# Altium schematic sheet switch.SchDoc: RF Switch
size Letter; CheckedBy: J. Brinton; CompanyName: Signal Laboratories, Inc.; DrawnBy: J. Brinton; Engineer: J. Brinton; Address1: 3479 Edison Way; Address2: Menlo Park CA 94025; Address3: +1 (877) 778-8435; Address4: siglabs.com; Revision: 3; SheetNumber: 16; SheetTotal: 49
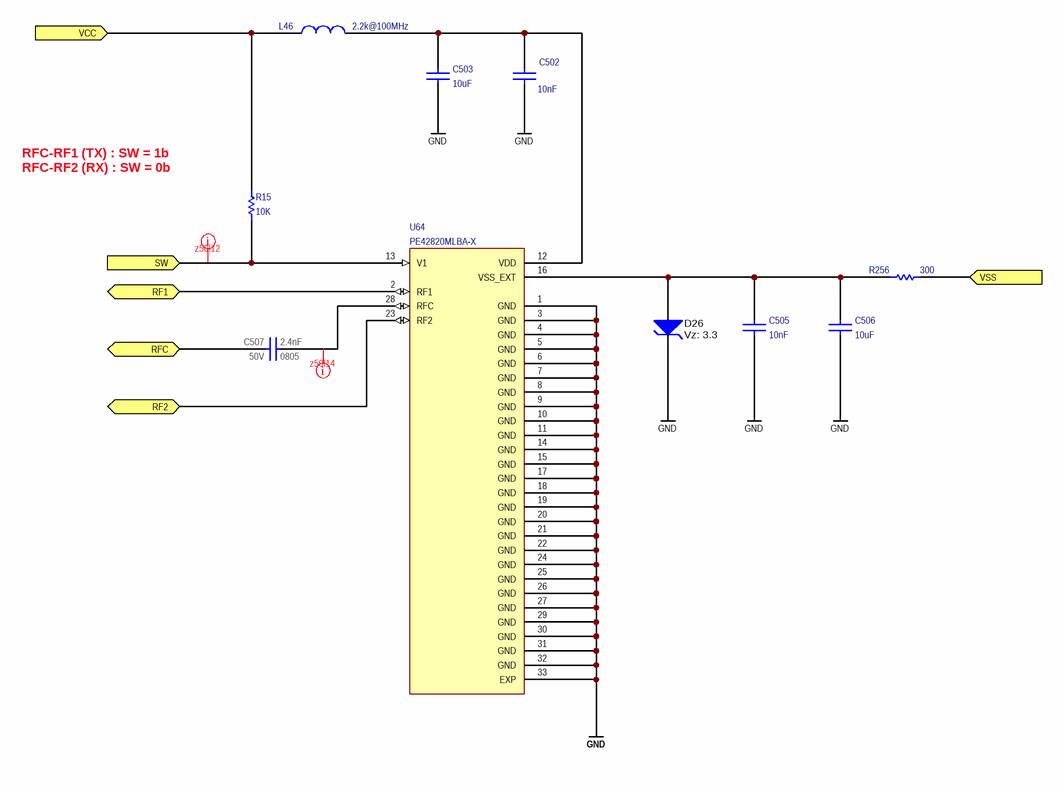
[diagram p0: switch.SchDoc]

## Parts
C502  value 10nF  [CAPC100X50X55L25N]  (hidden comment: GRM155R71H103KA88)
C503  value 10uF  [CAPC160X80X90L20N]  (hidden comment: ZRB18AR61E106ME01L)
C505  value 10nF  [CAPC100X50X55L25N]  (hidden comment: GRM155R71H103KA88)
C506  value 10uF  [CAPC160X80X90L20N]  (hidden comment: ZRB18AR61E106ME01L)
C507  value 2.4nF  Voltage: 50V  Package: 0805  [CAPC2012X145N]  (hidden comment: C08BL242X-5UN-X0T)
D26  Vz: 3.3  [SOD523]  (hidden comment: BZT585B3V3T-7)
L46  value 2.2k@100MHz  [INDC1005X55N]  (hidden comment: MMZ1005A222ET000)
R15  value 10K  [RESC1005X40N]  (hidden comment: ERJ-2RKF1002X)
R256  value 300  [RESC2012X70N]  (hidden comment: RG2012P-301-B-T5)
U64  PE42820MLBA-X  [QFN50P500X500X90-32N]

## Ports
RF1 (bidir), RF2 (bidir), RFC (bidir), SW (in), VCC (in), VSS (in)

## Nets
GND: C502.1 C503.1 C505.1 C506.1 D26.1(K) U64.1(GND) U64.3(GND) U64.4(GND) U64.5(GND) U64.6(GND) U64.7(GND) U64.8(GND) U64.9(GND) U64.10(GND) U64.11(GND) U64.14(GND) U64.15(GND) U64.17(GND) U64.18(GND) U64.19(GND) U64.20(GND) U64.21(GND) U64.22(GND) U64.24(GND) U64.25(GND) U64.26(GND) U64.27(GND) U64.29(GND) U64.30(GND) U64.31(GND) U64.32(GND) U64.33(EXP)
RF1: U64.2(RF1) ; port RF1
RF2: U64.23(RF2) ; port RF2
RFC: C507.2 ; port RFC
SW: R15.1 U64.13(V1) ; port SW
VCC: L46.1 R15.2 ; port VCC
VSS: R256.2 ; port VSS
NetC502_2: C502.2 C503.2 L46.2 U64.12(VDD)
NetC505_2: C505.2 C506.2 D26.2(A) R256.1 U64.16(VSS_EXT)
NetC507_1: C507.1 U64.28(RFC)

## Layout directives
net class z50l14: NetC507_1
net class z50l12: SW

## Notes on the sheet
- RFC-RF1 (TX) : SW = 1b
- RFC-RF2 (RX) : SW = 0b
- Title
- Engineer
- Revision
- Drawn By
- Checked By
- Date
- Sheet
- of

## Library data of the parts
C502 C505 = CAP 0402: Ceramic Capacitor 10nF ±10% 50V X7R 0402; Manufacturer: Murata; Tr: -55:125; Voltage: 50V; Manufacturer P/N: GRM155R71H103KA88; Package: 0402; Tolerance: ±10%
C503 C506 = CAP 0603: Ceramic Capacitor 10uF ±20% 25V X5R 0603; Manufacturer: Murata; Tr: -55:85; Manufacturer P/N: ZRB18AR61E106ME01L; Voltage: 25V; Package: 0603; Tolerance: ±20%
C507 = CAP: Ceramic Capacitor 2.4nF 50V 0805; Manufacturer: Dielectric Laboratories; Tr: -55:105; Manufacturer P/N: C08BL242X-5UN-X0T
D26 = ZENER: 3.3V Zener Diode SOD-523; Manufacturer: Diodes Inc; Manufacturer P/N: BZT585B3V3T-7
L46 = INDUCTANCE1: Ferrite Bead 2.2k@100MHz 150mA 0402; Manufacturer: TDK; Tr: -55:125; Manufacturer P/N: MMZ1005A222ET000; Package: 0402
R15 = RES 0402: Thick Film Resistor 10k ±1% 0.1W 50V 0402; Manufacturer: Panasonic; Tr: -55:155; Package: 0402; Manufacturer P/N: ERJ-2RKF1002X; Tolerance: ±1%
R256 = RES: Thin Film Resistor 300 +/-0.1% SMD 0805; Manufacturer: Susumu; Tolerance: ±0.1%; Tr: -55:155; Tcr: *; Manufacturer P/N: RG2012P-301-B-T5; Alternatives: *; Voltage: *; Power: *; Package: 0805
U64 = PE42820MLBA-X: RF Switch SPDT 30MHz to 2.7GHz 23dB 32-Pin QFN EP T/R; Manufacturer: Peregrine Semiconductor; Manufacturer P/N: PE42820MLBA-X; Package: QFN-32